# EAGLE design Flight_Controller_V1.0 (EAGLE 8.3.1)
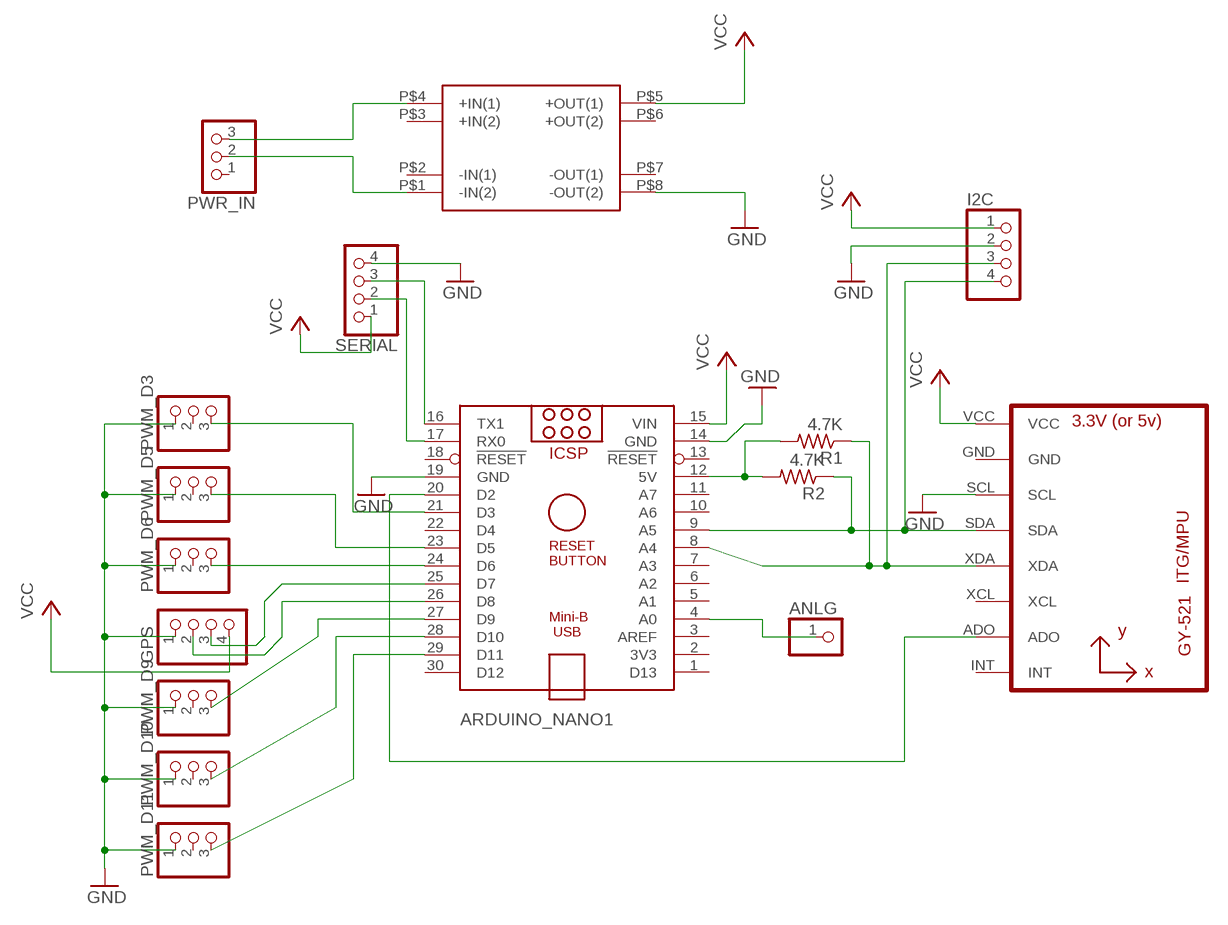
[diagram p0: schematic, sheet 1]

## Parts
ANLG  PINHD-1X1  [1X01]
ARDUINO_NANO1  ARDUINO_NANO  [ARDUINO_NANO]
GPS  PINHD-1X4  [1X04]
I2C  PINHD-1X4  [1X04]
PWM_D3  PINHD-1X3  [1X03]
PWM_D5  PINHD-1X3  [1X03]
PWM_D6  PINHD-1X3  [1X03]
PWM_D9  PINHD-1X3  [1X03]
PWM_D10  PINHD-1X3  [1X03]
PWM_D11  PINHD-1X3  [1X03]
PWR_IN  PINHD-1X3  [1X03]
R1  4.7K  R-US_R1206  [R1206]
R2  4.7K  R-US_R1206  [R1206]
SERIAL  PINHD-1X4  [1X04]
U1  GY-521MPU6050  [GY-521]
U$1  MP1584_DEVICETHROUGH_HOLE  [MP1584_PACKAGE]

## Nets
GND: ARDUINO_NANO1.14(GND) ARDUINO_NANO1.19(GND) GPS.1 I2C.2 PWM_D3.1 PWM_D5.1 PWM_D6.1 PWM_D9.1 PWM_D10.1 PWM_D11.1 SERIAL.4 U1.SCL U$1.P$8(-OUT(2))
N$1: ARDUINO_NANO1.17(RX0) SERIAL.2
N$2: ARDUINO_NANO1.16(TX1) SERIAL.3
N$3: ARDUINO_NANO1.20(D2) U1.ADO
N$4: PWR_IN.3 U$1.P$4(+IN(1))
N$5: ARDUINO_NANO1.12(5V) R1.2 R2.2
N$6: PWR_IN.2 U$1.P$1(-IN(2))
N$7: ARDUINO_NANO1.21(D3) PWM_D3.3
N$8: ARDUINO_NANO1.23(D5) PWM_D5.3
N$9: ARDUINO_NANO1.24(D6) PWM_D6.3
N$10: ARDUINO_NANO1.27(D9) PWM_D9.3
N$11: ARDUINO_NANO1.28(D10) PWM_D10.3
N$12: ARDUINO_NANO1.29(D11) PWM_D11.3
N$13: ANLG.1 ARDUINO_NANO1.4(A0)
N$14: ARDUINO_NANO1.25(D7) GPS.3
N$15: ARDUINO_NANO1.26(D8) GPS.2
SCL: ARDUINO_NANO1.9(A5) I2C.4 R2.1 U1.SDA
SDA: ARDUINO_NANO1.8(A4) I2C.3 R1.1 U1.XDA
VCC: ARDUINO_NANO1.15(VIN) GPS.4 I2C.1 SERIAL.1 U1.VCC U$1.P$5(+OUT(1))
Unconnected: ARDUINO_NANO1.1(D13) ARDUINO_NANO1.2(3V3) ARDUINO_NANO1.3(AREF) ARDUINO_NANO1.5(A1) ARDUINO_NANO1.6(A2) ARDUINO_NANO1.7(A3) ARDUINO_NANO1.10(A6) ARDUINO_NANO1.11(A7) ARDUINO_NANO1.13(!RESET) ARDUINO_NANO1.18(!RESET) ARDUINO_NANO1.22(D4) ARDUINO_NANO1.30(D12) PWM_D3.2 PWM_D5.2 PWM_D6.2 PWM_D9.2 PWM_D10.2 PWM_D11.2 PWR_IN.1 U1.GND U1.INT U1.XCL U$1.P$2(-IN(1)) U$1.P$3(+IN(2)) U$1.P$6(+OUT(2)) U$1.P$7(-OUT(1))

## Library data of the parts
ANLG = adafruit:PINHD-1X1: Pin header 1x1 for 0.1" spacing With round pins
ARDUINO_NANO1 = ArduinoNanoV30:ARDUINO_NANO: Arduino Nano V3.0 Overview: The Arduino Nano is a small, complete, and breadboard-friendly board based on the ATmega328 (Arduino Nano 3.x) or ATmega168 (Arduino Nano 2.x). It has more or less the same functionality of the Arduino Duemilanove, but in a different package. It lacks only a DC power jack, and works with a Mini-B USB cable instead of a standard one. The Nano was designed and is being produced by Gravitech. Specifications: Microcontroller Atmel ATmega168 or ATmega328 Operating Voltage (logic level) 5 V Input Voltage (recommended) 7-12 V Input Voltage (limits) 6-20 V Digital I/O Pins 14 (of which 6 provide PWM output) Analog Input Pins 8 DC Current per I/O Pin 40 mA Flash Memory 16 KB (ATmega168) or 32 KB (ATmega328) of which 2 KB used by bootloader SRAM 1 KB (ATmega168) or 2 KB (ATmega328) EEPROM 512 bytes (ATmega168) or 1 KB (ATmega328) Clock Speed 16 MHz Dimensions 0.73" x 1.70" Length 45 mm Width 18 mm Weigth 5 g Power: The Arduino Nano can be powered via the Mini-B USB connection, 6-20V unregulated external power supply (pin 30), or 5V regulated external power supply (pin 27). The power source is automatically selected to the highest voltage source. Memory: The ATmega168 has 16 KB of flash memory for storing code (of which 2 KB is used for the bootloader); the ATmega328 has 32 KB, (also with 2 KB used for the bootloader). The ATmega168 has 1 KB of SRAM and 512 bytes of EEPROM (which can be read and written with the EEPROM library); the ATmega328 has 2 KB of SRAM and 1 KB of EEPROM. Input and Output: Each of the 14 digital pins on the Nano can be used as an input or output, using pinMode(), digitalWrite(), and digitalRead() functions. They operate at 5 volts. Each pin can provide or receive a maximum of 40 mA and has an internal pull-up resistor (disconnected by default) of 20-50 kOhms. In addition, some pins have specialized functions. Visit Arduino - ArduinoBoardNano <https://www.arduino.cc/en/Main/ArduinoBoardNano>
GPS I2C SERIAL = pinhead:PINHD-1X4: PIN HEADER
PWM_D3 PWM_D5 PWM_D6 PWM_D9-PWM_D11 PWR_IN = adafruit:PINHD-1X3: PIN HEADER
R1 R2 = resistor:R-US_: RESISTOR, American symbol
U1 = gy-521:GY-521
U$1 = MP1584:MP1584_DEVICE

## Net classes
0 default: width 0.305 mm, drill 0.508 mm, clearance 0.254 mm
1 Net1: width 0.559 mm, drill 0.508 mm, clearance 0.305 mm

## Board
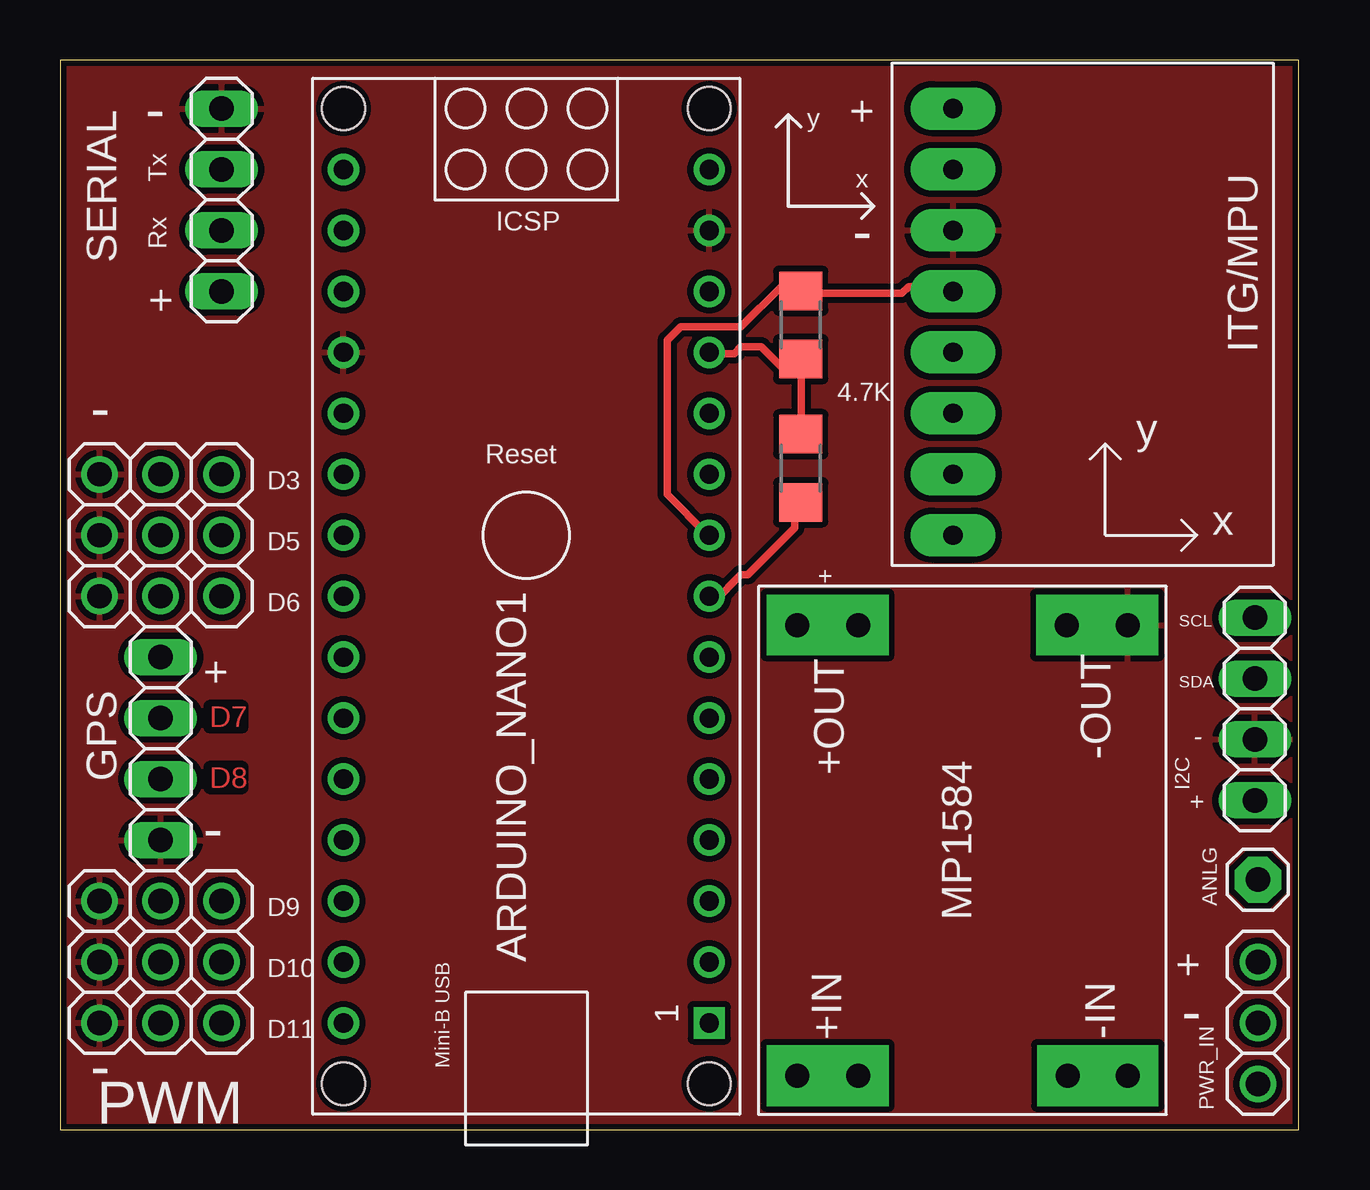
[diagram p1: board, top side]
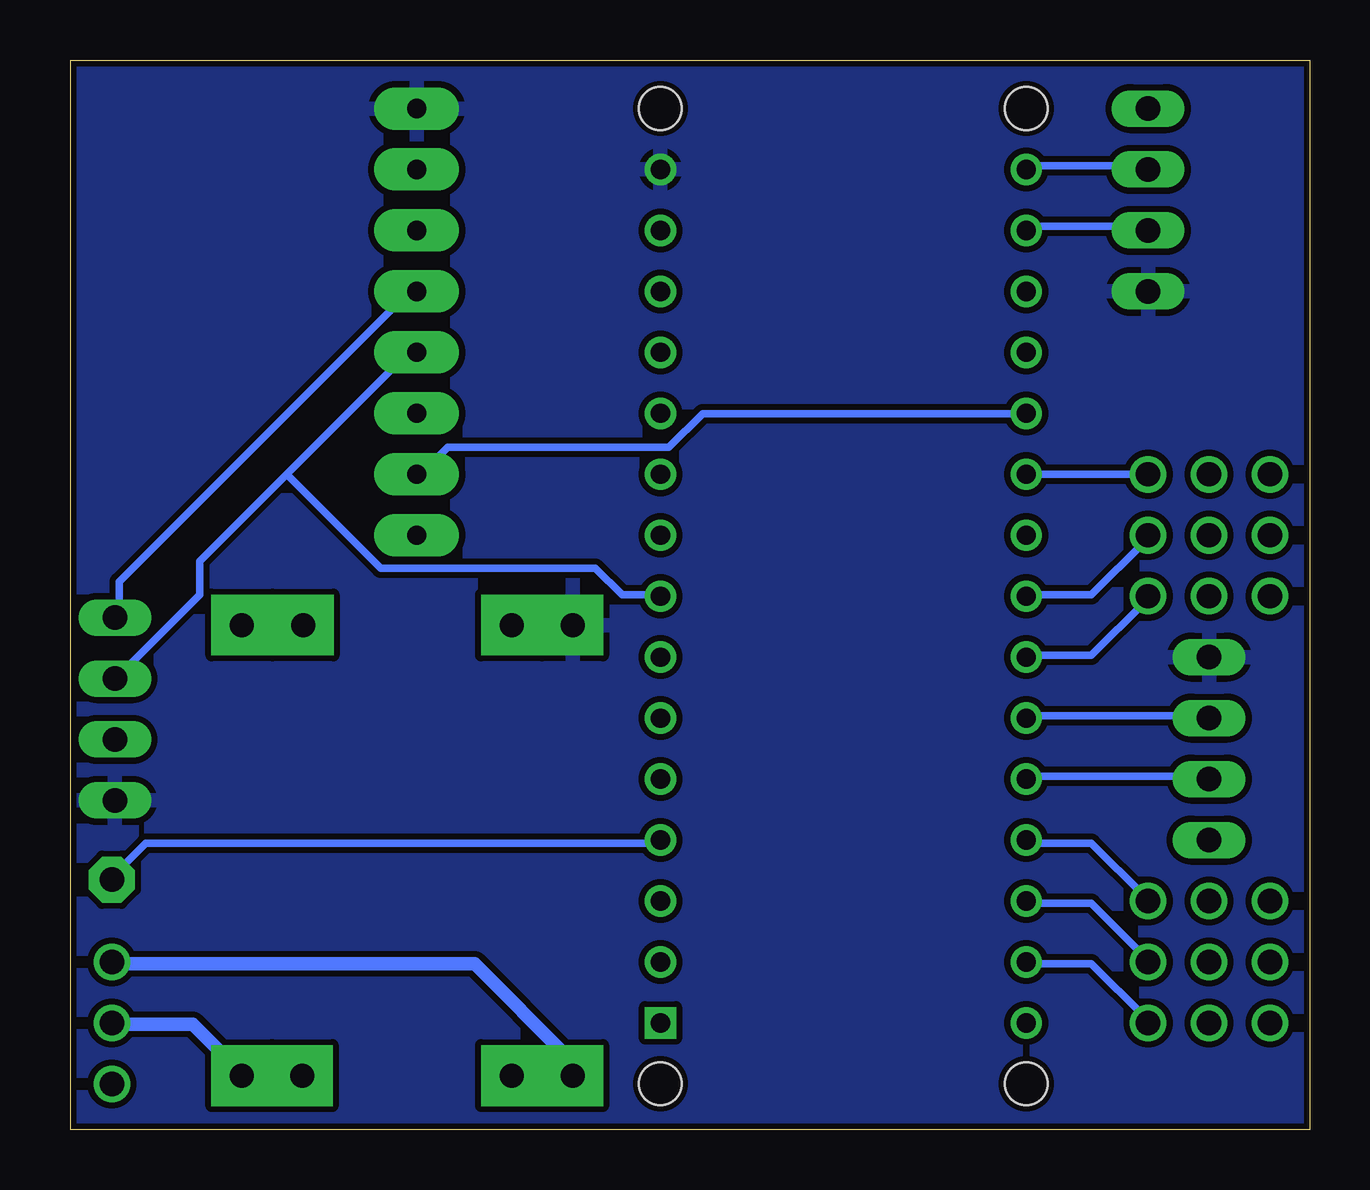
[diagram p2: board, bottom side, seen from below]

Size 51.61 x 44.57 mm. Coordinates in mm from the lower left corner, seen from the top.
Outline: 0,0 51.61,0 51.61,44.57 0,44.57 0,0
Copper layers (1*16): Top 0.035mm / dielectric 1.5mm / Bottom 0.035mm
Design rules "default *": minimum track width 6mil, minimum drill 0.35mm, track to track 6mil, track to pad 6mil, pad to pad 6mil, via to via 6mil, smd to smd 6mil, copper to edge 10mil, drill to drill 6mil, minimum pad ring 10mil, minimum via ring 8mil, stop-mask expansion 4mil, vias tented up to drill 0mil, thermal gap 10mil

### Footprints (pad centres in the part's own frame; a part is rotated, then mirrored left to right if it is on the bottom)
1X01 = drill 1.016 pad 1.93 octagon: 1 0,0
ARDUINO_NANO = drill 0.8 square: 1 -20.32,-7.62 | drill 0.8: 2 -17.78,-7.62; 3 -15.24,-7.62; 4 -12.7,-7.62; 5 -10.16,-7.62; 6 -7.62,-7.62; 7 -5.08,-7.62; 8 -2.54,-7.62; 9 0,-7.62; 10 2.54,-7.62; 11 5.08,-7.62; 12 7.62,-7.62; 13 10.16,-7.62; 14 12.7,-7.62; 15 15.24,-7.62; 16 15.24,7.62; 17 12.7,7.62; 18 10.16,7.62; 19 7.62,7.62; 20 5.08,7.62; 21 2.54,7.62; 22 0,7.62; 23 -2.54,7.62; 24 -5.08,7.62; 25 -7.62,7.62; 26 -10.16,7.62; 27 -12.7,7.62; 28 -15.24,7.62; 29 -17.78,7.62; 30 -20.32,7.62 | hole 1.778: -22.86,-7.62; -22.86,7.62; 17.78,7.62; 17.78,-7.62
1X04 = drill 1.016 long: 1 -3.81,0; 2 -1.27,0; 3 1.27,0; 4 3.81,0
1X03 = drill 1.016: 1 -2.54,0; 2 0,0; 3 2.54,0
R1206 = smd 1.6 x 1.803: 1 -1.422,0; 2 1.422,0
GY-521 = drill 0.8 pad 1.778 long: ADO -8.89,-6.35; GND -8.89,6.35; INT -8.89,-8.89; SCL -8.89,3.81; SDA -8.89,1.27; VCC -8.89,8.89; XCL -8.89,-3.81; XDA -8.89,-1.27
MP1584_PACKAGE = drill 1 pad 2.54 square: P$1 1.61,1.61; P$2 1.61,4.119; P$3 1.61,12.85; P$4 1.61,15.39; P$5 20.39,15.39; P$6 20.39,12.85; P$7 20.39,4.16; P$8 20.39,1.61

### Placement (x,y rotation side)
ANLG  49.91,10.41 0 top
ARDUINO_NANO1  19.43,24.76 90 top
GPS  4.19,15.88 90 top
I2C  49.78,17.53 90 top
PWM_D3  4.19,27.3 0 top
PWM_D5  4.19,24.76 0 top
PWM_D6  4.19,22.22 0 top
PWM_D9  4.19,9.52 0 top
PWM_D10  4.19,6.98 0 top
PWM_D11  4.19,4.45 0 top
PWR_IN  49.91,4.45 90 top
R1  30.86,27.56 90 top
R2  30.86,33.53 270 top
SERIAL  6.73,38.73 90 top
U1  46.1,33.66 0 top
U$1  46.1,0.63 90 top

### Tracks (layer width: path | path; a pad name or v marks a point on that pad's centre or on a via)
GND
  pour Top: -0.38,44.83 -0.38,-0.38 51.94,-0.38 51.94,44.83
N$1
  Bottom 0.305: ARDUINO_NANO1.17 11.61,37.64 6.86,37.64 SERIAL.2
N$2
  Bottom 0.305: ARDUINO_NANO1.16 11.61,40.16 6.86,40.16 SERIAL.3
N$3
  Bottom 0.305: ARDUINO_NANO1.20 11.89,29.82 25.3,29.82 26.7,28.42 35.92,28.42 37.03,27.3 U1.ADO
N$4
  Bottom 0.305: 49.89,6.91 PWR_IN.3
  Bottom 0.559: 49.89,6.91 34.8,6.91 30.89,3 30.89,2.44 U$1.P$4
N$5
  Top 0.305: 30.89,31.78 30.89,32.05 R2.2 30.89,31.78 | 30.89,31.78 30.89,28.98 R1.2 | 30.89,31.78 30.05,31.78 29.21,32.61 28.37,32.61 28.09,32.33 27.25,32.33 ARDUINO_NANO1.12
N$6
  Bottom 0.305: 49.89,4.39 PWR_IN.2 | 44.58,2.44 U$1.P$1
  Bottom 0.559: 49.89,4.39 46.53,4.39 44.58,2.44
N$7
  Bottom 0.305: PWM_D3.3 ARDUINO_NANO1.21
N$8
  Bottom 0.305: ARDUINO_NANO1.23 11.61,22.28 9.09,22.28 6.86,24.51 PWM_D5.3
N$9
  Bottom 0.305: ARDUINO_NANO1.24 11.61,19.76 9.09,19.76 6.86,22 PWM_D6.3
N$10
  Bottom 0.305: ARDUINO_NANO1.27 11.61,11.94 9.09,11.94 6.86,9.7 PWM_D9.3
N$11
  Bottom 0.305: ARDUINO_NANO1.28 11.61,9.42 9.09,9.42 6.86,7.19 PWM_D10.3
N$12
  Bottom 0.305: ARDUINO_NANO1.29 11.61,6.91 9.09,6.91 6.86,4.67 PWM_D11.3
N$13
  Bottom 0.305: ARDUINO_NANO1.4 27.25,11.94 48.49,11.94 49.89,10.54 ANLG.1
N$14
  Bottom 0.305: ARDUINO_NANO1.25 11.61,17.25 4.34,17.25 GPS.3
N$15
  Bottom 0.305: ARDUINO_NANO1.26 11.61,14.73 4.34,14.73 GPS.2
SCL
  Top 0.305: U1.SDA 37.03,35.13 35.36,35.13 35.08,34.85 30.89,34.85 R2.1 30.61,35.13 30.05,35.13 28.37,33.45 25.86,33.45 25.3,32.89 25.3,26.47 26.98,24.79 ARDUINO_NANO1.9
  Bottom 0.305: I2C.4 49.61,21.44 49.61,22.83 37.31,35.13 U1.SDA
SDA
  Top 0.305: R1.1 30.61,25.91 30.61,25.07 28.65,23.11 28.37,23.11 27.25,22 ARDUINO_NANO1.8
  Bottom 0.305: 42.62,27.3 37.31,32.61 U1.XDA | 42.62,27.3 46.25,23.67 46.25,22.28 49.61,18.92 I2C.3 | 42.62,27.3 38.71,23.39 29.77,23.39 28.65,22.28 27.25,22.28 ARDUINO_NANO1.8
VCC
  pour Bottom: -0.89,45.08 52.45,45.08 52.45,-0.63 -0.89,-0.63

### Text on the board
Top: D7 | D8
tSilk: - | y | Tx | x | Rx | - | 4.7K | - | D3 | D5 | D6 | SCL | SDA | - | - | D9 | D10 | - | D11 | - | PWM
_tsilk: + | + | + | + | + | +